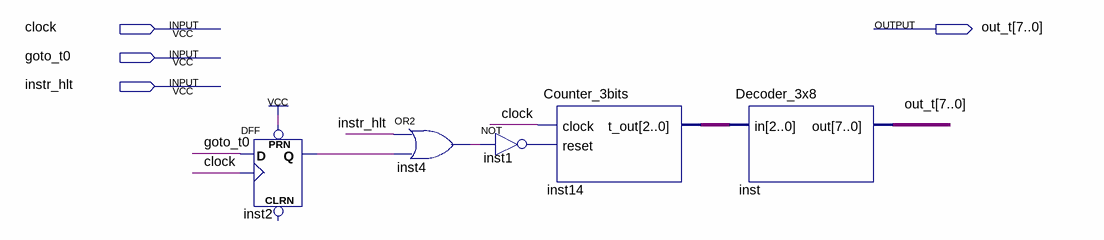
[diagram p0: schematic sheet]
// Quartus schematic Timer.bdf as structural Verilog: 5 symbols, 4 pins
module Timer (
  input  clock,
  input  goto_t0,
  input  instr_hlt,
  output [7:0] out_t
);

  wire inst1_out, inst2_q, inst4_out;
  wire [2:0] inst14_t_out;

  DFF inst2 (.CLK(clock), .D(goto_t0), .PRN(1'b1), .Q(inst2_q));  // open: CLRN
  or inst4 (inst4_out, instr_hlt, inst2_q);
  not inst1 (inst1_out, inst4_out);
  Counter_3bits inst14 (.clock(clock), .reset(inst1_out), .t_out(inst14_t_out));
  Decoder_3x8 inst (.in(inst14_t_out), .out(out_t));
endmodule
